# Altium schematic sheet PWR_SEPIC_P12V_N12V.SchDoc: Sayma RTM
size 420 x 297 mm; $$Internal___BlkDate: 23:43:25_12-13-18; $$Internal_NAME_PLACEHOLDER: a3sheet; $$Internal_Resolution: 00001mm; $$NotCommonProperty_@NAME: PWR_SEPIC_P12V_N12V; $$NotCommonProperty_@PRINTORDER: 6; $$NotCommonProperty_@SHEET: 1; $$NotCommonProperty_@SHEETTOTAL: 1; CmpIndex: 12; Drawing Author: G.Kasprowicz; Drawing Number: Sayma RTM; Drawing Project: 8 channel SAWG; Drawing Revision: 2.0; SymIndex: 2227; Author: G.Kasprowicz; CompanyName: WUT ISE; DrawnBy: G.Kasprowicz; Organization: WUT ISE; Address1: PW ISE; Address2: Nowowiejska 15/19 00-665 Warsaw; Address3: gkasprow@gmail.com; DocumentNumber: 16; Revision: 1.0; SheetNumber: 16; SheetTotal: 18; ModifiedBy: -; CheckedDate: -; Title2: +/- 12V SEPIC; DivGrp: WUT ISE; Designer: G.Kasprowicz; ModifiedDate: -; ProjectName: Sensor Box
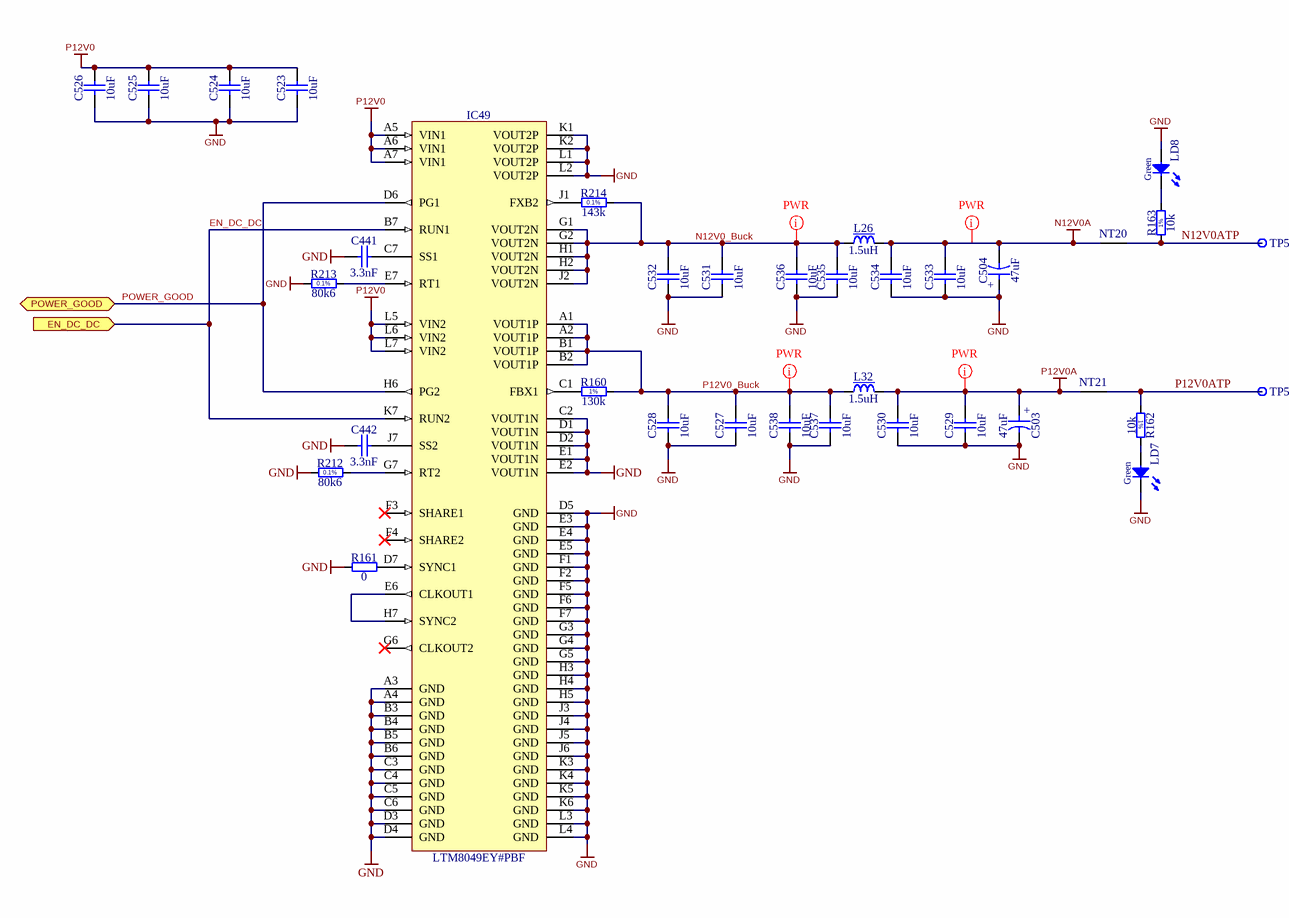
[diagram p0: PWR_SEPIC_P12V_N12V.SchDoc]

## Parts
C441  3.3nF  [CAPC1005X55N]
C442  3.3nF  [CAPC1005X55N]
C503  47uF  [CAPMP6032X280N]
C504  47uF  [CAPMP6032X280N]
C523  10uF  [CAPC2012X95N]
C524  10uF  [CAPC2012X95N]
C525  10uF  [CAPC2012X95N]
C526  10uF  [CAPC2012X95N]
C527  10uF  [CAPC2012X95N]
C528  10uF  [CAPC2012X95N]
C529  10uF  [CAPC2012X95N]
C530  10uF  [CAPC2012X95N]
C531  10uF  [CAPC2012X95N]
C532  10uF  [CAPC2012X95N]
C533  10uF  [CAPC2012X95N]
C534  10uF  [CAPC2012X95N]
C535  10uF  [CAPC2012X95N]
C536  10uF  [CAPC2012X95N]
C537  10uF  [CAPC2012X95N]
C538  10uF  [CAPC2012X95N]
IC49  LTM8049EY#PBF  [BGA77C127P7X11_900X1500X262]
L26  1.5uH  [IND_TDK_SPM6530]
L32  1.5uH  [IND_TDK_SPM6530]
LD7  Green  [LED_KINGBRIGHT_KPH-1608CGCK]
LD8  Green  [LED_KINGBRIGHT_KPH-1608CGCK]
NT20  Net Tie  [Net Tie]  (value not drawn)  (net tie, no BOM)
NT21  Net Tie  [Net Tie]  (value not drawn)  (net tie, no BOM)
R160  130k  [RESC1005X40N]
R161  0  [RESC1005X40N]
R162  10k  [RESC1005X40N]
R163  10k  [RESC1005X40N]
R212  80k6  [RESC1608X55N]
R213  80k6  [RESC1608X55N]
R214  143k  [RESC1608X55N]
TP55  Test Point  [TPS127]  (value not drawn)
TP56  Test Point  [TPS127]  (value not drawn)

## Ports
EN_DC_DC (in), POWER_GOOD (bidir)

## Nets
GND: C441.1 C442.1 C503.2 C504.1 C523.1 C524.1 C525.1 C526.1 C527.1 C528.1 C529.1 C530.1 C531.1 C532.1 C533.1 C534.1 C535.1 C536.1 C537.1 C538.1 IC49.A3(GND) IC49.A4(GND) IC49.B3(GND) IC49.B4(GND) IC49.B5(GND) IC49.B6(GND) IC49.C2(VOUT1N) IC49.C3(GND) IC49.C4(GND) IC49.C5(GND) IC49.C6(GND) IC49.D1(VOUT1N) IC49.D2(VOUT1N) IC49.D3(GND) IC49.D4(GND) IC49.D5(GND) IC49.E1(VOUT1N) IC49.E2(VOUT1N) IC49.E3(GND) IC49.E4(GND) IC49.E5(GND) IC49.F1(GND) IC49.F2(GND) IC49.F5(GND) IC49.F6(GND) IC49.F7(GND) IC49.G3(GND) IC49.G4(GND) IC49.G5(GND) IC49.H3(GND) IC49.H4(GND) IC49.H5(GND) IC49.J3(GND) IC49.J4(GND) IC49.J5(GND) IC49.J6(GND) IC49.K1(VOUT2P) IC49.K2(VOUT2P) IC49.K3(GND) IC49.K4(GND) IC49.K5(GND) IC49.K6(GND) IC49.L1(VOUT2P) IC49.L2(VOUT2P) IC49.L3(GND) IC49.L4(GND) LD7.1(C) LD8.2(A) R161.1 R212.1 R213.1
N12V0A: C504.2 C533.2 C534.2 L26.2 NT20.1
P12V0: C523.2 C524.2 C525.2 C526.2 IC49.A5(VIN1) IC49.A6(VIN1) IC49.A7(VIN1) IC49.L5(VIN2) IC49.L6(VIN2) IC49.L7(VIN2)
P12V0A: C503.1 C529.2 C530.2 L32.2 NT21.1
EN_DC_DC: IC49.B7(RUN1) IC49.K7(RUN2) ; port EN_DC_DC
N12V0_Buck: C531.2 C532.2 C535.2 C536.2 IC49.G1(VOUT2N) IC49.G2(VOUT2N) IC49.H1(VOUT2N) IC49.H2(VOUT2N) IC49.J2(VOUT2N) L26.1 R214.2
N12V0ATP: NT20.2 R163.1 TP55.1
P12V0_Buck: C527.2 C528.2 C537.2 C538.2 IC49.A1(VOUT1P) IC49.A2(VOUT1P) IC49.B1(VOUT1P) IC49.B2(VOUT1P) L32.1 R160.2
P12V0ATP: NT21.2 R162.1 TP56.1
POWER_GOOD: IC49.D6(PG1) IC49.H6(PG2) ; port POWER_GOOD
NetC441_2: C441.2 IC49.C7(SS1)
NetC442_2: C442.2 IC49.J7(SS2)
NetIC49_C1: IC49.C1(FBX1) R160.1
NetIC49_D7: IC49.D7(SYNC1) R161.2
NetIC49_E6: IC49.E6(CLKOUT1) IC49.H7(SYNC2)
NetIC49_E7: IC49.E7(RT1) R213.2
NetIC49_G7: IC49.G7(RT2) R212.2
NetIC49_J1: IC49.J1(FXB2) R214.1
NetLD7_2: LD7.2(A) R162.2
NetLD8_1: LD8.1(C) R163.2

Not connected (* = marked no-connect by the designer): IC49 F3(SHARE1)* F4(SHARE2)* G6(CLKOUT2)*

## Layout directives
net class PWR: N12V0_Buck, N12V0A, P12V0_Buck, P12V0A

## Notes on the sheet
- Project/Equipment
- Document
- Designer
- Drawn by
- Check.by
- Copyright WUT ISE 2018.
  This documentation describes Open Hardware and is licensed under the CERN OHL v.1.1. You may redistribute and modify this documentation under the terms of the CERN OHL v.1.1. (http://ohwr.org/CERNOHL). This documentation is distributed WITHOUT ANY EXPRESS OR IMPLIED WARRANTY, INCLUDING OF MERCHANTABILITY, SATISFACTORY QUALITY AND FITNESS FOR A PARTICULAR PURPOSE. Please see the CERN OHL v.1.1 for applicable conditions.
- Contact
- File
- Last Mod.
- Print Date
- Sheet
- Size
- A3
- of
- Rev
- (in symbol CTE6032-28_47UF_16V_10%_LESR0350) +
- (in symbol R0402_10K_1%_0.0625W_100PPM) 1%
- (in symbol R0402_130K_1%_0.0625W_100PPM) 1%
- (in symbol R0603_80K6_0.1%_0.063W_10PPM) 0.1%
- (in symbol R0603_143K_0.1%_0.063W_10PPM) 0.1%

## Library data of the parts
C441 C442 = CC0402_3.3NF_50V_10%_X7R: Non-polarised capacitor; Manufacturer: GENERIC; Manufacturer1 Part Number: 223858715629; Part Description: SMD Multilayer Chip Ceramic Capacitor; TC: X7R; Tolerance: ±10%; Voltage: 50V; Case: 0402; Manufacturer Part Number: CC0402_3.3NF_50V_10%_X7R; Manufacturer1 Example: PHYCOMP; Part Number: CC0402_3.3NF_50V_10%_X7R; Pin Count: 2; SMD: Yes; Status: Not Recommended; Value: 3.3nF; Component Kind: Standard; Component Type: Standard; Mounted: Yes; Socket: No; Sense: No; Manufacturer1 ComponentHeight: 0.55mm; HelpURL: \\cern.ch\dfs\Applications\Altium\Datasheets\CC0402_X7R_PHYCOMP.pdf; Author: CERN DEM JLC; CreateDate: 03.12.2007; LatestRevisionDate: 03.12.2007
C503 C504 = CTE6032-28_47UF_16V_10%_LESR0350: Polarised capacitor; Manufacturer: GENERIC; Manufacturer1 Part Number: TPSC476K016R0350; Part Description: Low ESR 0R350 Solid Tantalum Chip Capacitor; Tolerance: ±10%; Voltage: 16V; Case: C; Manufacturer Part Number: CTE6032-28_47UF_16V_10%_LESR0350; Manufacturer1 Example: AVX; Part Number: CTE6032-28_47UF_16V_10%_LESR0350; Pin Count: 2; SMD: Yes; Value: 47uF; Component Kind: Standard; Component Type: Standard; Status: Preferred; Mounted: Yes; Socket: No; Sense: No; Manufacturer1 ComponentHeight: 2.8mm; HelpURL: \\cern.ch\dfs\Applications\Altium\Datasheets\CTE-LESR_AVX_TPS.pdf; Author: CERN DEM JLC; CreateDate: 05.05.2008; LatestRevisionDate: 20.01.2009
C523-C538 = CC0805_10UF_25V_10%_X5R: Non-polarised capacitor; Manufacturer: GENERIC; Manufacturer1 Part Number: GRM219R61E106KA12D; Part Description: SMD Multilayer Chip Ceramic Capacitor; TC: X5R; Tolerance: ±10%; Voltage: 25V; Case: 0805; Manufacturer Part Number: CC0805_10UF_25V_10%_X5R; Manufacturer1 Example: MURATA; Part Number: CC0805_10UF_25V_10%_X5R; Pin Count: 2; SMD: Yes; Status: Preferred; Value: 10uF; Component Kind: Standard; Component Type: Standard; Mounted: Yes; Socket: No; Sense: No; Manufacturer1 ComponentHeight: 0.95mm; HelpURL: \\cern.ch\dfs\Applications\Altium\Datasheets\CC0805_X5R_MURATA_GRM.pdf; Author: CERN DEM JLC; CreateDate: 25.10.2012; LatestRevisionDate: 06.09.2016
IC49 = LTM8049EY#PBF: Dual SEPIC or Inverting uModule DC/DC Converter; Manufacturer: LINEAR TECHNOLOGY; PressFit: No; Bonding: No; Part Number: LTM8049EY#PBF; Component Kind: Standard; Component Type: Standard; Device: LTM8049EY#PBF; PackageDescription: BGA, 1.27mm Pitch, Rect.; 77 Pin, 7 Columns X 11 Rows, 9.00mm X 15.00mm X 2.62mm H; Part Description: Dual SEPIC or Inverting uModule DC/DC Converter; Manufacturer Part Number: LTM8049EY#PBF; Pin Count: 77; Case: BGA77; Mounted: Yes; Socket: No; SMD: Yes; Sense: No; ComponentHeight: 2.62mm; HelpURL: \\cern.ch\dfs\Applications\Altium\Datasheets\LTM8049EY#PBF.pdf; Author: CERN DEM JLC; CreateDate: 08.12.2016; LatestRevisionDate: 08.12.2016
L26 L32 = IND_1.5UH_20%_TDK_SPM6530: Inductor With Core; Manufacturer Part Number: SPM6530T-1R5M100; Manufacturer: TDK; Part Description: SMD Inductor for Power Circuits (Wound Metal), SPM Series; Power: 11A; Resistance: 0.0097R; Tolerance: ±20%; ComponentHeight: 3mm; Part Number: IND_1.5UH_20%_TDK_SPM6530; Pin Count: 2; SMD: Yes; Value: 1.5uH; Component Kind: Standard; Component Type: Standard; Status: None; Mounted: Yes; Socket: No; Sense: No; HelpURL: \\cern.ch\dfs\Applications\Altium\Datasheets\IND_TDK_SPM6530.pdf; Author: CERN DEM MR; CreateDate: 08.11.2016; LatestRevisionDate: 08.11.2016
LD7 LD8 = LED_KINGBRIGHT_KPH-1608CGCK: LED Green 1C 2A; Part Description: SMD Green LED, Case 1.6mmX0.8mm(0603), 0.65mm Thickness; Bonding: No; PressFit: No; Author: CERN DEM JLC; Color: Green; Component Kind: Standard; Component Type: Standard; ComponentHeight: 0.65mm; CreateDate: 03.07.2017; HelpURL: \\cern.ch\dfs\Applications\Altium\Datasheets\LED_KINGBRIGHT_KPH-1608CGCK.pdf; LatestRevisionDate: 03.07.2017; Manufacturer Part Number: KPH-1608CGCK; Manufacturer: KINGBRIGHT; Mounted: Yes; PackageDescription: SMT Green LED, Case 0603, Body L 1.6 x W 0.8mm H 0.65mm; Part Number: LED_KINGBRIGHT_KPH-1608CGCK; Pin Count: 2; Sense: No; SMD: Yes; Socket: No
NT20 NT21 = Net Tie: Part Description: Net Tie (2 Nets); Mounted: No; Part Number: Net Tie; Component Type: Net Tie; Pin Count: 2; Family: Net Tie; Socket: No; SMD: No; Sense: No; Status: None; ComponentHeight: 0mm; HelpURL: Undefined; Author: CERN DEM JLC; CreateDate: 22.03.2011; LatestRevisionDate: 22.03.2011; PackageDescription: 2 Plated Through Hole For Coaxial Cable Link: Hole Dia.=1.4mm Pad Dia.=2.5mm
R160 = R0402_130K_1%_0.0625W_100PPM: Resistor - 1%; Manufacturer: GENERIC; Manufacturer1 Part Number: 232270671304L; Part Description: General Purpose Thick Film Chip Resistor; TC: ±100ppm/°C; PressFit: No; Case: 0402; Manufacturer Part Number: R0402_130K_1%_0.0625W_100PPM; Manufacturer1 ComponentHeight: 0.4mm; Manufacturer1 Example: YAGEO PHYCOMP; Part Number: R0402_130K_1%_0.0625W_100PPM; Pin Count: 2; Power: 0.0625W; Sense: No; SMD: Yes; Status: Not Recommended; Tolerance: ±1%; Value: 130k; Component Kind: Standard; Component Type: Standard; Mounted: Yes; Socket: No; HelpURL: \\cern.ch\dfs\Applications\Altium\Datasheets\R0402_Phycomp_RC0402.pdf; Author: CERN DEM JLC; CreateDate: 03.12.2007; LatestRevisionDate: 17.10.2012
R161 = R0402_0R_JUMPER: Resistor; Manufacturer: GENERIC; Manufacturer1 Part Number: 232270591001L; Part Description: 1A (0.05R Max DC Resistance) Zero Ohm Jumper; PressFit: No; Case: 0402; Manufacturer Part Number: R0402_0R_JUMPER; Manufacturer1 ComponentHeight: 0.4mm; Manufacturer1 Example: YAGEO PHYCOMP; Part Number: R0402_0R_JUMPER; Pin Count: 2; Sense: No; SMD: Yes; Status: Not Recommended; Value: 0; Component Kind: Standard; Component Type: Standard; Mounted: Yes; Socket: No; HelpURL: \\cern.ch\dfs\Applications\Altium\Datasheets\R0402_Phycomp_RC0402.pdf; Author: CERN DEM JLC; CreateDate: 03.12.2007; LatestRevisionDate: 17.10.2012
R162 R163 = R0402_10K_1%_0.0625W_100PPM: Resistor - 1%; Manufacturer: GENERIC; Manufacturer1 Part Number: 232270671003L; Part Description: General Purpose Thick Film Chip Resistor; TC: ±100ppm/°C; PressFit: No; Case: 0402; Manufacturer Part Number: R0402_10K_1%_0.0625W_100PPM; Manufacturer1 ComponentHeight: 0.4mm; Manufacturer1 Example: YAGEO PHYCOMP; Part Number: R0402_10K_1%_0.0625W_100PPM; Pin Count: 2; Power: 0.0625W; Sense: No; SMD: Yes; Status: Not Recommended; Tolerance: ±1%; Value: 10k; Component Kind: Standard; Component Type: Standard; Mounted: Yes; Socket: No; HelpURL: \\cern.ch\dfs\Applications\Altium\Datasheets\R0402_Phycomp_RC0402.pdf; Author: CERN DEM JLC; CreateDate: 03.12.2007; LatestRevisionDate: 17.10.2012
R212 R213 = R0603_80K6_0.1%_0.063W_10PPM: Resistor - 0.1%; Manufacturer: GENERIC; Manufacturer1 Part Number: RN73C1J80K6BTDF; Part Description: Thin Film Chip Resistor; Power: 0.063W; TC: ±10ppm; PressFit: No; Case: 0603; Manufacturer Part Number: R0603_80K6_0.1%_0.063W_10PPM; Manufacturer1 ComponentHeight: 0.5mm; Manufacturer1 Example: TYCO HOLSWORTHY; Part Number: R0603_80K6_0.1%_0.063W_10PPM; Pin Count: 2; Sense: No; SMD: Yes; Status: Not Recommended; Tolerance: ±0.1%; Value: 80k6; Component Kind: Standard; Component Type: Standard; Mounted: Yes; Socket: No; HelpURL: \\cern.ch\dfs\Applications\Altium\Datasheets\R0603_Tyco_RN73.pdf; Author: CERN DEM JLC; CreateDate: 03.12.2007; LatestRevisionDate: 13.03.2008
R214 = R0603_143K_0.1%_0.063W_10PPM: Resistor - 0.1%; Manufacturer: GENERIC; Manufacturer1 Part Number: RN73C1J143KBTDF; Part Description: Thin Film Chip Resistor; Power: 0.063W; TC: ±10ppm; PressFit: No; Case: 0603; Manufacturer Part Number: R0603_143K_0.1%_0.063W_10PPM; Manufacturer1 ComponentHeight: 0.5mm; Manufacturer1 Example: TYCO HOLSWORTHY; Part Number: R0603_143K_0.1%_0.063W_10PPM; Pin Count: 2; Sense: No; SMD: Yes; Status: Not Recommended; Tolerance: ±0.1%; Value: 143k; Component Kind: Standard; Component Type: Standard; Mounted: Yes; Socket: No; HelpURL: \\cern.ch\dfs\Applications\Altium\Datasheets\R0603_Tyco_RN73.pdf; Author: CERN DEM JLC; CreateDate: 03.12.2007; LatestRevisionDate: 13.03.2008
TP55 TP56 = SMD_PAD_1.27X1.27MM: Part Description: 1.27mm x 1.27mm PCB Copper Area (SMD Test Point); Mounted: No; ComponentHeight: 0mm; Family: Test Point; Part Number: SMD_PAD_1.27X1.27MM; Pin Count: 1; Sense: No; SMD: Yes; Socket: No; Status: None; Component Kind: Standard (No BOM); Component Type: Standard (No BOM); HelpURL: Undefined; Author: CERN DEM JLC; CreateDate: 12.01.2008; LatestRevisionDate: 12.01.2008; PackageDescription: 1.27mm x 1.27mm PCB Copper Area (SMD Test Point)